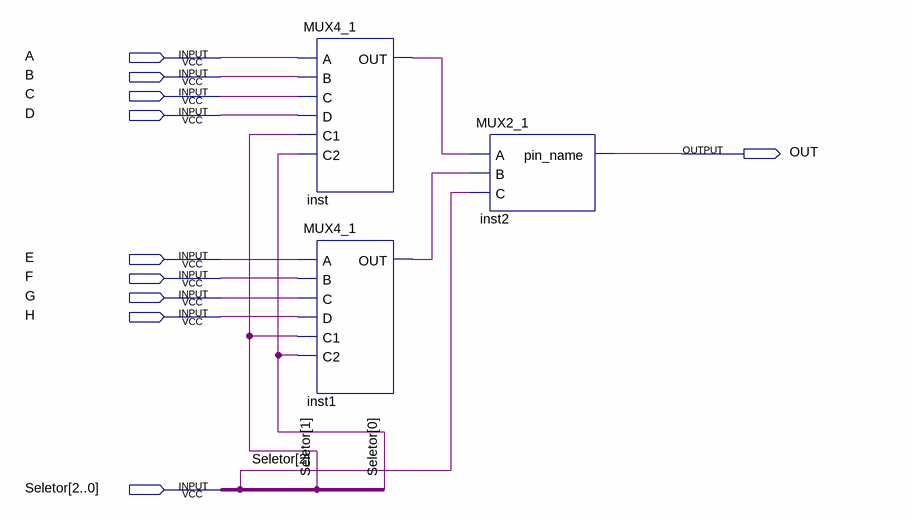
[diagram p0: schematic sheet]
// Quartus schematic MUX8_1.bdf as structural Verilog: 3 symbols, 10 pins
module MUX8_1 (
  input  A,
  input  B,
  input  C,
  input  D,
  input  E,
  input  F,
  input  G,
  input  H,
  input  [2:0] Seletor,
  output OUT
);

  wire inst1_out, inst_out;

  MUX4_1 inst (.A(A), .B(B), .C(C), .D(D), .C1(Seletor[1]), .C2(Seletor[0]), .OUT(inst_out));
  MUX4_1 inst1 (.A(E), .B(F), .C(G), .D(H), .C1(Seletor[1]), .C2(Seletor[0]), .OUT(inst1_out));
  MUX2_1 inst2 (.A(inst_out), .B(inst1_out), .C(Seletor[2]), .pin_name(OUT));
endmodule
